# Altium schematic sheet wifi_sensor.SchDoc
size A4
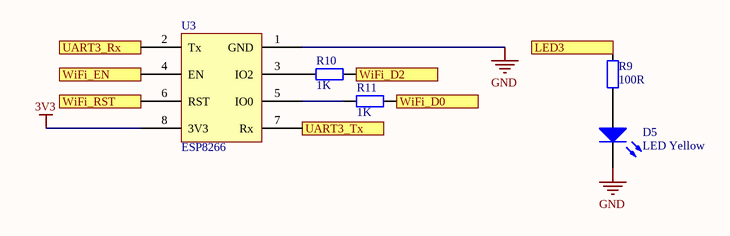
[diagram p0: wifi_sensor.SchDoc]

## Parts
D5  LED Yellow  [FP_0805_LED_RED]
R9  100R  [FP_0805_RES]
R10  1K  [FP_0805_RES]
R11  1K  [FP_0805_RES]
U3  ESP8266  [HDR2X4]

## Ports
LED3, UART3_Rx, UART3_Tx, WiFi_D0, WiFi_D2, WiFi_EN, WiFi_RST

## Nets
3V3: U3.8(3V3)
GND: D5.2(K) U3.1(GND)
LED3: R9.2 ; port LED3
UART3_Rx: U3.2(Tx) ; port UART3_Rx
UART3_Tx: U3.7(Rx) ; port UART3_Tx
WiFi_D0: R11.2 ; port WiFi_D0
WiFi_D2: R10.2 ; port WiFi_D2
WiFi_EN: U3.4(EN) ; port WiFi_EN
WiFi_RST: U3.6(RST) ; port WiFi_RST
NetD5_1: D5.1(A) R9.1
NetR10_1: R10.1 U3.3(IO2)
NetR11_1: R11.1 U3.5(IO0)

## Library data of the parts
D5 = LED Yellow: Yellow LED; pin to pad: 1>A 2>K; U_fw: 2.1V; I_max: 20mA; Name: 2012 YELLOW 590nm 220mcd 0805UYC (FEM) 20mA W.CLEAR 2.0x1.2x0.68mm 0805 140°; Wavelength: 590nm; Supplier: Lomex; Reference: 95-03-84
R9 = RES 100R: Resistor; Tolerance: 5%; Power: 125mW; Name: YAGEO (PHYCOMP)  RC0805JR-07100RL  SMD Chip Resistor, Thick Film, 100 ohm,; Reference: 9233881; Supplier: Farnell; Value: 100R
R10 R11 = RES 1K: Resistor; Tolerance: 5%; Power: 125mW; Name: YAGEO (PHYCOMP)  RC0805JR-071KL  SMD Chip Resistor, Thick Film, 1 kohm; Reference: 9234004; Supplier: Farnell; Value: 1K